# Altium schematic sheet 0015_Processor - MEMORY.SchDoc
size A3
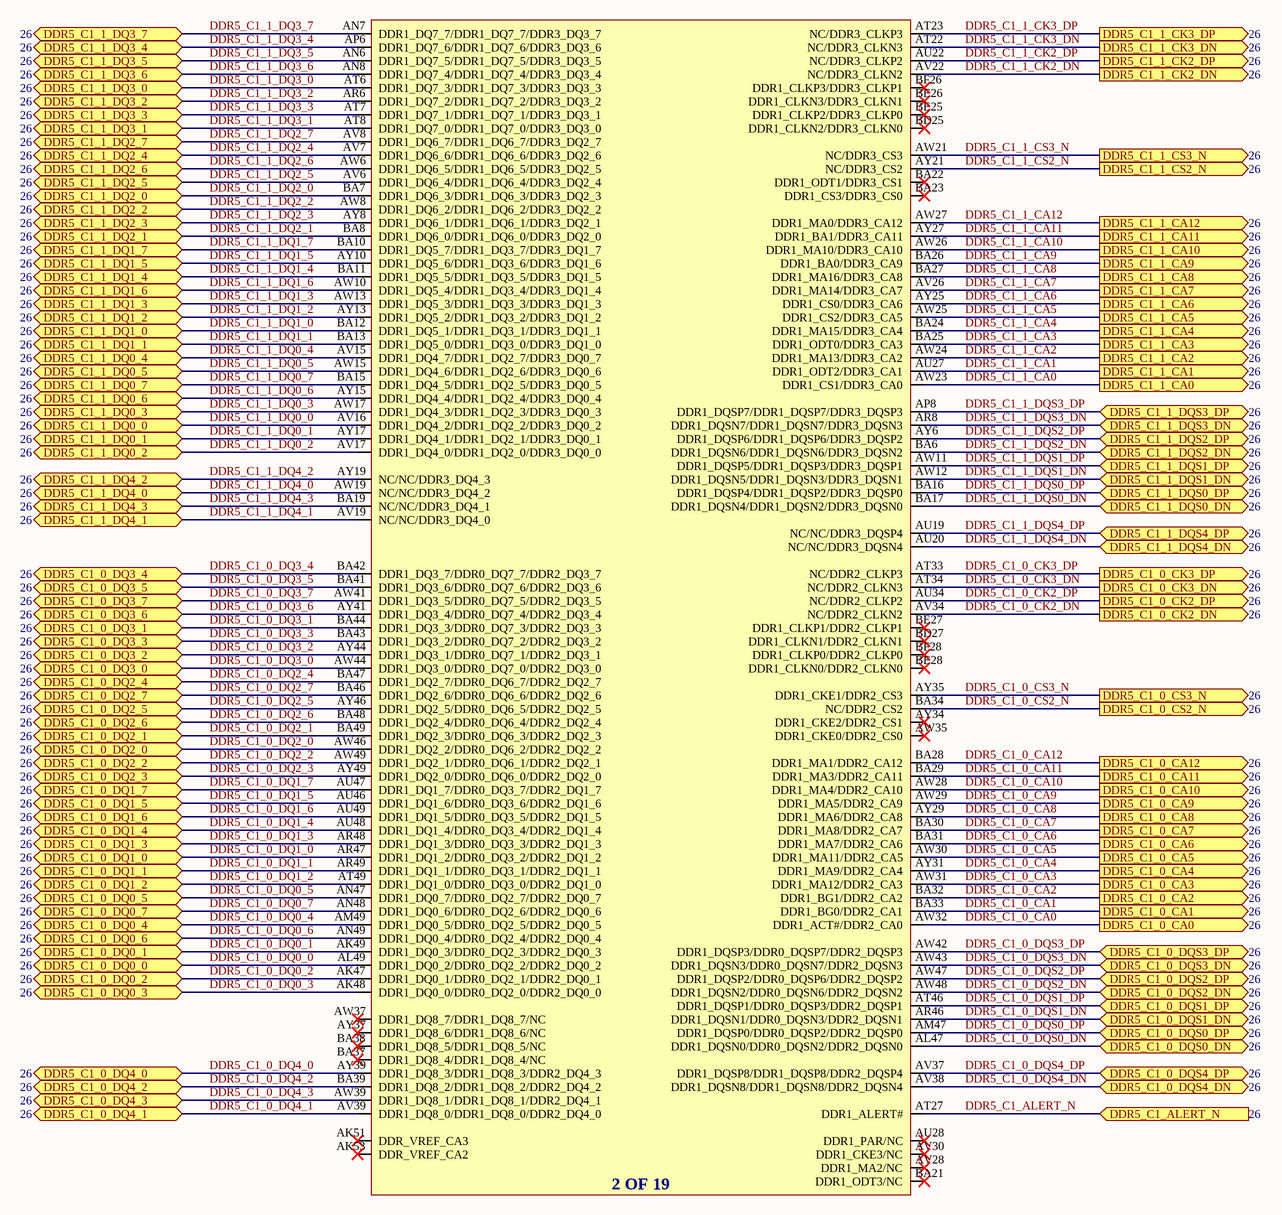
[diagram p0: 0015_Processor - MEMORY.SchDoc]

## Parts
U1401  C_RPL_HX_EXT  (value not drawn)  (part B of 19)

## Ports
DDR5_C1_0_CA0 (out), DDR5_C1_0_CA1 (out), DDR5_C1_0_CA2 (out), DDR5_C1_0_CA3 (out), DDR5_C1_0_CA4 (out), DDR5_C1_0_CA5 (out), DDR5_C1_0_CA6 (out), DDR5_C1_0_CA7 (out), DDR5_C1_0_CA8 (out), DDR5_C1_0_CA9 (out), DDR5_C1_0_CA10 (out), DDR5_C1_0_CA11 (out), DDR5_C1_0_CA12 (out), DDR5_C1_0_CK2_DN (out), DDR5_C1_0_CK2_DP (out), DDR5_C1_0_CK3_DN (out), DDR5_C1_0_CK3_DP (out), DDR5_C1_0_CS2_N (out), DDR5_C1_0_CS3_N (out), DDR5_C1_0_DQ0_0 (bidir), DDR5_C1_0_DQ0_1 (bidir), DDR5_C1_0_DQ0_2 (bidir), DDR5_C1_0_DQ0_3 (bidir), DDR5_C1_0_DQ0_4 (bidir), DDR5_C1_0_DQ0_5 (bidir), DDR5_C1_0_DQ0_6 (bidir), DDR5_C1_0_DQ0_7 (bidir), DDR5_C1_0_DQ1_0 (bidir), DDR5_C1_0_DQ1_1 (bidir), DDR5_C1_0_DQ1_2 (bidir), DDR5_C1_0_DQ1_3 (bidir), DDR5_C1_0_DQ1_4 (bidir), DDR5_C1_0_DQ1_5 (bidir), DDR5_C1_0_DQ1_6 (bidir), DDR5_C1_0_DQ1_7 (bidir), DDR5_C1_0_DQ2_0 (bidir), DDR5_C1_0_DQ2_1 (bidir), DDR5_C1_0_DQ2_2 (bidir), DDR5_C1_0_DQ2_3 (bidir), DDR5_C1_0_DQ2_4 (bidir), DDR5_C1_0_DQ2_5 (bidir), DDR5_C1_0_DQ2_6 (bidir), DDR5_C1_0_DQ2_7 (bidir), DDR5_C1_0_DQ3_0 (bidir), DDR5_C1_0_DQ3_1 (bidir), DDR5_C1_0_DQ3_2 (bidir), DDR5_C1_0_DQ3_3 (bidir), DDR5_C1_0_DQ3_4 (bidir), DDR5_C1_0_DQ3_5 (bidir), DDR5_C1_0_DQ3_6 (bidir), DDR5_C1_0_DQ3_7 (bidir), DDR5_C1_0_DQ4_0 (bidir), DDR5_C1_0_DQ4_1 (bidir), DDR5_C1_0_DQ4_2 (bidir), DDR5_C1_0_DQ4_3 (bidir), DDR5_C1_0_DQS0_DN (bidir), DDR5_C1_0_DQS0_DP (bidir), DDR5_C1_0_DQS1_DN (bidir), DDR5_C1_0_DQS1_DP (bidir), DDR5_C1_0_DQS2_DN (bidir), DDR5_C1_0_DQS2_DP (bidir), DDR5_C1_0_DQS3_DN (bidir), DDR5_C1_0_DQS3_DP (bidir), DDR5_C1_0_DQS4_DN (bidir), DDR5_C1_0_DQS4_DP (bidir), DDR5_C1_1_CA0 (out), DDR5_C1_1_CA1 (out), DDR5_C1_1_CA2 (out), DDR5_C1_1_CA3 (out), DDR5_C1_1_CA4 (out), DDR5_C1_1_CA5 (out), DDR5_C1_1_CA6 (out), DDR5_C1_1_CA7 (out), DDR5_C1_1_CA8 (out), DDR5_C1_1_CA9 (out), DDR5_C1_1_CA10 (out), DDR5_C1_1_CA11 (out), DDR5_C1_1_CA12 (out), DDR5_C1_1_CK2_DN (out), DDR5_C1_1_CK2_DP (out), DDR5_C1_1_CK3_DN (out), DDR5_C1_1_CK3_DP (out), DDR5_C1_1_CS2_N (out), DDR5_C1_1_CS3_N (out), DDR5_C1_1_DQ0_0 (bidir), DDR5_C1_1_DQ0_1 (bidir), DDR5_C1_1_DQ0_2 (bidir), DDR5_C1_1_DQ0_3 (bidir), DDR5_C1_1_DQ0_4 (bidir), DDR5_C1_1_DQ0_5 (bidir), DDR5_C1_1_DQ0_6 (bidir), DDR5_C1_1_DQ0_7 (bidir), DDR5_C1_1_DQ1_0 (bidir), DDR5_C1_1_DQ1_1 (bidir), DDR5_C1_1_DQ1_2 (bidir), DDR5_C1_1_DQ1_3 (bidir), DDR5_C1_1_DQ1_4 (bidir), DDR5_C1_1_DQ1_5 (bidir), DDR5_C1_1_DQ1_6 (bidir), DDR5_C1_1_DQ1_7 (bidir), DDR5_C1_1_DQ2_0 (bidir), DDR5_C1_1_DQ2_1 (bidir), DDR5_C1_1_DQ2_2 (bidir), DDR5_C1_1_DQ2_3 (bidir), DDR5_C1_1_DQ2_4 (bidir), DDR5_C1_1_DQ2_5 (bidir), DDR5_C1_1_DQ2_6 (bidir), DDR5_C1_1_DQ2_7 (bidir), DDR5_C1_1_DQ3_0 (bidir), DDR5_C1_1_DQ3_1 (bidir), DDR5_C1_1_DQ3_2 (bidir), DDR5_C1_1_DQ3_3 (bidir), DDR5_C1_1_DQ3_4 (bidir), DDR5_C1_1_DQ3_5 (bidir), DDR5_C1_1_DQ3_6 (bidir), DDR5_C1_1_DQ3_7 (bidir), DDR5_C1_1_DQ4_0 (bidir), DDR5_C1_1_DQ4_1 (bidir), DDR5_C1_1_DQ4_2 (bidir), DDR5_C1_1_DQ4_3 (bidir), DDR5_C1_1_DQS0_DN (bidir), DDR5_C1_1_DQS0_DP (bidir), DDR5_C1_1_DQS1_DN (bidir), DDR5_C1_1_DQS1_DP (bidir), DDR5_C1_1_DQS2_DN (bidir), DDR5_C1_1_DQS2_DP (bidir), DDR5_C1_1_DQS3_DN (bidir), DDR5_C1_1_DQS3_DP (bidir), DDR5_C1_1_DQS4_DN (bidir), DDR5_C1_1_DQS4_DP (bidir), DDR5_C1_ALERT_N (in)

## Nets
DDR5_C1_0_CA0: U1401.AW32(DDR1_ACT#/DDR2_CA0) ; port DDR5_C1_0_CA0
DDR5_C1_0_CA1: U1401.BA33(DDR1_BG0/DDR2_CA1) ; port DDR5_C1_0_CA1
DDR5_C1_0_CA2: U1401.BA32(DDR1_BG1/DDR2_CA2) ; port DDR5_C1_0_CA2
DDR5_C1_0_CA3: U1401.AW31(DDR1_MA12/DDR2_CA3) ; port DDR5_C1_0_CA3
DDR5_C1_0_CA4: U1401.AY31(DDR1_MA9/DDR2_CA4) ; port DDR5_C1_0_CA4
DDR5_C1_0_CA5: U1401.AW30(DDR1_MA11/DDR2_CA5) ; port DDR5_C1_0_CA5
DDR5_C1_0_CA6: U1401.BA31(DDR1_MA7/DDR2_CA6) ; port DDR5_C1_0_CA6
DDR5_C1_0_CA7: U1401.BA30(DDR1_MA8/DDR2_CA7) ; port DDR5_C1_0_CA7
DDR5_C1_0_CA8: U1401.AY29(DDR1_MA6/DDR2_CA8) ; port DDR5_C1_0_CA8
DDR5_C1_0_CA9: U1401.AW29(DDR1_MA5/DDR2_CA9) ; port DDR5_C1_0_CA9
DDR5_C1_0_CA10: U1401.AW28(DDR1_MA4/DDR2_CA10) ; port DDR5_C1_0_CA10
DDR5_C1_0_CA11: U1401.BA29(DDR1_MA3/DDR2_CA11) ; port DDR5_C1_0_CA11
DDR5_C1_0_CA12: U1401.BA28(DDR1_MA1/DDR2_CA12) ; port DDR5_C1_0_CA12
DDR5_C1_0_CK2_DN: U1401.AV34(NC/DDR2_CLKN2) ; port DDR5_C1_0_CK2_DN
DDR5_C1_0_CK2_DP: U1401.AU34(NC/DDR2_CLKP2) ; port DDR5_C1_0_CK2_DP
DDR5_C1_0_CK3_DN: U1401.AT34(NC/DDR2_CLKN3) ; port DDR5_C1_0_CK3_DN
DDR5_C1_0_CK3_DP: U1401.AT33(NC/DDR2_CLKP3) ; port DDR5_C1_0_CK3_DP
DDR5_C1_0_CS2_N: U1401.BA34(NC/DDR2_CS2) ; port DDR5_C1_0_CS2_N
DDR5_C1_0_CS3_N: U1401.AY35(DDR1_CKE1/DDR2_CS3) ; port DDR5_C1_0_CS3_N
DDR5_C1_0_DQ0_0: U1401.AL49(DDR1_DQ0_2/DDR0_DQ2_2/DDR2_DQ0_2) ; port DDR5_C1_0_DQ0_0
DDR5_C1_0_DQ0_1: U1401.AK49(DDR1_DQ0_3/DDR0_DQ2_3/DDR2_DQ0_3) ; port DDR5_C1_0_DQ0_1
DDR5_C1_0_DQ0_2: U1401.AK47(DDR1_DQ0_1/DDR0_DQ2_1/DDR2_DQ0_1) ; port DDR5_C1_0_DQ0_2
DDR5_C1_0_DQ0_3: U1401.AK48(DDR1_DQ0_0/DDR0_DQ2_0/DDR2_DQ0_0) ; port DDR5_C1_0_DQ0_3
DDR5_C1_0_DQ0_4: U1401.AM49(DDR1_DQ0_5/DDR0_DQ2_5/DDR2_DQ0_5) ; port DDR5_C1_0_DQ0_4
DDR5_C1_0_DQ0_5: U1401.AN47(DDR1_DQ0_7/DDR0_DQ2_7/DDR2_DQ0_7) ; port DDR5_C1_0_DQ0_5
DDR5_C1_0_DQ0_6: U1401.AN49(DDR1_DQ0_4/DDR0_DQ2_4/DDR2_DQ0_4) ; port DDR5_C1_0_DQ0_6
DDR5_C1_0_DQ0_7: U1401.AN48(DDR1_DQ0_6/DDR0_DQ2_6/DDR2_DQ0_6) ; port DDR5_C1_0_DQ0_7
DDR5_C1_0_DQ1_0: U1401.AR47(DDR1_DQ1_2/DDR0_DQ3_2/DDR2_DQ1_2) ; port DDR5_C1_0_DQ1_0
DDR5_C1_0_DQ1_1: U1401.AR49(DDR1_DQ1_1/DDR0_DQ3_1/DDR2_DQ1_1) ; port DDR5_C1_0_DQ1_1
DDR5_C1_0_DQ1_2: U1401.AT49(DDR1_DQ1_0/DDR0_DQ3_0/DDR2_DQ1_0) ; port DDR5_C1_0_DQ1_2
DDR5_C1_0_DQ1_3: U1401.AR48(DDR1_DQ1_3/DDR0_DQ3_3/DDR2_DQ1_3) ; port DDR5_C1_0_DQ1_3
DDR5_C1_0_DQ1_4: U1401.AU48(DDR1_DQ1_4/DDR0_DQ3_4/DDR2_DQ1_4) ; port DDR5_C1_0_DQ1_4
DDR5_C1_0_DQ1_5: U1401.AU46(DDR1_DQ1_6/DDR0_DQ3_6/DDR2_DQ1_6) ; port DDR5_C1_0_DQ1_5
DDR5_C1_0_DQ1_6: U1401.AU49(DDR1_DQ1_5/DDR0_DQ3_5/DDR2_DQ1_5) ; port DDR5_C1_0_DQ1_6
DDR5_C1_0_DQ1_7: U1401.AU47(DDR1_DQ1_7/DDR0_DQ3_7/DDR2_DQ1_7) ; port DDR5_C1_0_DQ1_7
DDR5_C1_0_DQ2_0: U1401.AW46(DDR1_DQ2_2/DDR0_DQ6_2/DDR2_DQ2_2) ; port DDR5_C1_0_DQ2_0
DDR5_C1_0_DQ2_1: U1401.BA49(DDR1_DQ2_3/DDR0_DQ6_3/DDR2_DQ2_3) ; port DDR5_C1_0_DQ2_1
DDR5_C1_0_DQ2_2: U1401.AW49(DDR1_DQ2_1/DDR0_DQ6_1/DDR2_DQ2_1) ; port DDR5_C1_0_DQ2_2
DDR5_C1_0_DQ2_3: U1401.AY49(DDR1_DQ2_0/DDR0_DQ6_0/DDR2_DQ2_0) ; port DDR5_C1_0_DQ2_3
DDR5_C1_0_DQ2_4: U1401.BA47(DDR1_DQ2_7/DDR0_DQ6_7/DDR2_DQ2_7) ; port DDR5_C1_0_DQ2_4
DDR5_C1_0_DQ2_5: U1401.AY46(DDR1_DQ2_5/DDR0_DQ6_5/DDR2_DQ2_5) ; port DDR5_C1_0_DQ2_5
DDR5_C1_0_DQ2_6: U1401.BA48(DDR1_DQ2_4/DDR0_DQ6_4/DDR2_DQ2_4) ; port DDR5_C1_0_DQ2_6
DDR5_C1_0_DQ2_7: U1401.BA46(DDR1_DQ2_6/DDR0_DQ6_6/DDR2_DQ2_6) ; port DDR5_C1_0_DQ2_7
DDR5_C1_0_DQ3_0: U1401.AW44(DDR1_DQ3_0/DDR0_DQ7_0/DDR2_DQ3_0) ; port DDR5_C1_0_DQ3_0
DDR5_C1_0_DQ3_1: U1401.BA44(DDR1_DQ3_3/DDR0_DQ7_3/DDR2_DQ3_3) ; port DDR5_C1_0_DQ3_1
DDR5_C1_0_DQ3_2: U1401.AY44(DDR1_DQ3_1/DDR0_DQ7_1/DDR2_DQ3_1) ; port DDR5_C1_0_DQ3_2
DDR5_C1_0_DQ3_3: U1401.BA43(DDR1_DQ3_2/DDR0_DQ7_2/DDR2_DQ3_2) ; port DDR5_C1_0_DQ3_3
DDR5_C1_0_DQ3_4: U1401.BA42(DDR1_DQ3_7/DDR0_DQ7_7/DDR2_DQ3_7) ; port DDR5_C1_0_DQ3_4
DDR5_C1_0_DQ3_5: U1401.BA41(DDR1_DQ3_6/DDR0_DQ7_6/DDR2_DQ3_6) ; port DDR5_C1_0_DQ3_5
DDR5_C1_0_DQ3_6: U1401.AY41(DDR1_DQ3_4/DDR0_DQ7_4/DDR2_DQ3_4) ; port DDR5_C1_0_DQ3_6
DDR5_C1_0_DQ3_7: U1401.AW41(DDR1_DQ3_5/DDR0_DQ7_5/DDR2_DQ3_5) ; port DDR5_C1_0_DQ3_7
DDR5_C1_0_DQ4_0: U1401.AY39(DDR1_DQ8_3/DDR1_DQ8_3/DDR2_DQ4_3) ; port DDR5_C1_0_DQ4_0
DDR5_C1_0_DQ4_1: U1401.AV39(DDR1_DQ8_0/DDR1_DQ8_0/DDR2_DQ4_0) ; port DDR5_C1_0_DQ4_1
DDR5_C1_0_DQ4_2: U1401.BA39(DDR1_DQ8_2/DDR1_DQ8_2/DDR2_DQ4_2) ; port DDR5_C1_0_DQ4_2
DDR5_C1_0_DQ4_3: U1401.AW39(DDR1_DQ8_1/DDR1_DQ8_1/DDR2_DQ4_1) ; port DDR5_C1_0_DQ4_3
DDR5_C1_0_DQS0_DN: U1401.AL47(DDR1_DQSN0/DDR0_DQSN2/DDR2_DQSN0) ; port DDR5_C1_0_DQS0_DN
DDR5_C1_0_DQS0_DP: U1401.AM47(DDR1_DQSP0/DDR0_DQSP2/DDR2_DQSP0) ; port DDR5_C1_0_DQS0_DP
DDR5_C1_0_DQS1_DN: U1401.AR46(DDR1_DQSN1/DDR0_DQSN3/DDR2_DQSN1) ; port DDR5_C1_0_DQS1_DN
DDR5_C1_0_DQS1_DP: U1401.AT46(DDR1_DQSP1/DDR0_DQSP3/DDR2_DQSP1) ; port DDR5_C1_0_DQS1_DP
DDR5_C1_0_DQS2_DN: U1401.AW48(DDR1_DQSN2/DDR0_DQSN6/DDR2_DQSN2) ; port DDR5_C1_0_DQS2_DN
DDR5_C1_0_DQS2_DP: U1401.AW47(DDR1_DQSP2/DDR0_DQSP6/DDR2_DQSP2) ; port DDR5_C1_0_DQS2_DP
DDR5_C1_0_DQS3_DN: U1401.AW43(DDR1_DQSN3/DDR0_DQSN7/DDR2_DQSN3) ; port DDR5_C1_0_DQS3_DN
DDR5_C1_0_DQS3_DP: U1401.AW42(DDR1_DQSP3/DDR0_DQSP7/DDR2_DQSP3) ; port DDR5_C1_0_DQS3_DP
DDR5_C1_0_DQS4_DN: U1401.AV38(DDR1_DQSN8/DDR1_DQSN8/DDR2_DQSN4) ; port DDR5_C1_0_DQS4_DN
DDR5_C1_0_DQS4_DP: U1401.AV37(DDR1_DQSP8/DDR1_DQSP8/DDR2_DQSP4) ; port DDR5_C1_0_DQS4_DP
DDR5_C1_1_CA0: U1401.AW23(DDR1_CS1/DDR3_CA0) ; port DDR5_C1_1_CA0
DDR5_C1_1_CA1: U1401.AU27(DDR1_ODT2/DDR3_CA1) ; port DDR5_C1_1_CA1
DDR5_C1_1_CA2: U1401.AW24(DDR1_MA13/DDR3_CA2) ; port DDR5_C1_1_CA2
DDR5_C1_1_CA3: U1401.BA25(DDR1_ODT0/DDR3_CA3) ; port DDR5_C1_1_CA3
DDR5_C1_1_CA4: U1401.BA24(DDR1_MA15/DDR3_CA4) ; port DDR5_C1_1_CA4
DDR5_C1_1_CA5: U1401.AW25(DDR1_CS2/DDR3_CA5) ; port DDR5_C1_1_CA5
DDR5_C1_1_CA6: U1401.AY25(DDR1_CS0/DDR3_CA6) ; port DDR5_C1_1_CA6
DDR5_C1_1_CA7: U1401.AV26(DDR1_MA14/DDR3_CA7) ; port DDR5_C1_1_CA7
DDR5_C1_1_CA8: U1401.BA27(DDR1_MA16/DDR3_CA8) ; port DDR5_C1_1_CA8
DDR5_C1_1_CA9: U1401.BA26(DDR1_BA0/DDR3_CA9) ; port DDR5_C1_1_CA9
DDR5_C1_1_CA10: U1401.AW26(DDR1_MA10/DDR3_CA10) ; port DDR5_C1_1_CA10
DDR5_C1_1_CA11: U1401.AY27(DDR1_BA1/DDR3_CA11) ; port DDR5_C1_1_CA11
DDR5_C1_1_CA12: U1401.AW27(DDR1_MA0/DDR3_CA12) ; port DDR5_C1_1_CA12
DDR5_C1_1_CK2_DN: U1401.AV22(NC/DDR3_CLKN2) ; port DDR5_C1_1_CK2_DN
DDR5_C1_1_CK2_DP: U1401.AU22(NC/DDR3_CLKP2) ; port DDR5_C1_1_CK2_DP
DDR5_C1_1_CK3_DN: U1401.AT22(NC/DDR3_CLKN3) ; port DDR5_C1_1_CK3_DN
DDR5_C1_1_CK3_DP: U1401.AT23(NC/DDR3_CLKP3) ; port DDR5_C1_1_CK3_DP
DDR5_C1_1_CS2_N: U1401.AY21(NC/DDR3_CS2) ; port DDR5_C1_1_CS2_N
DDR5_C1_1_CS3_N: U1401.AW21(NC/DDR3_CS3) ; port DDR5_C1_1_CS3_N
DDR5_C1_1_DQ0_0: U1401.AV16(DDR1_DQ4_2/DDR1_DQ2_2/DDR3_DQ0_2) ; port DDR5_C1_1_DQ0_0
DDR5_C1_1_DQ0_1: U1401.AY17(DDR1_DQ4_1/DDR1_DQ2_1/DDR3_DQ0_1) ; port DDR5_C1_1_DQ0_1
DDR5_C1_1_DQ0_2: U1401.AV17(DDR1_DQ4_0/DDR1_DQ2_0/DDR3_DQ0_0) ; port DDR5_C1_1_DQ0_2
DDR5_C1_1_DQ0_3: U1401.AW17(DDR1_DQ4_3/DDR1_DQ2_3/DDR3_DQ0_3) ; port DDR5_C1_1_DQ0_3
DDR5_C1_1_DQ0_4: U1401.AV15(DDR1_DQ4_7/DDR1_DQ2_7/DDR3_DQ0_7) ; port DDR5_C1_1_DQ0_4
DDR5_C1_1_DQ0_5: U1401.AW15(DDR1_DQ4_6/DDR1_DQ2_6/DDR3_DQ0_6) ; port DDR5_C1_1_DQ0_5
DDR5_C1_1_DQ0_6: U1401.AY15(DDR1_DQ4_4/DDR1_DQ2_4/DDR3_DQ0_4) ; port DDR5_C1_1_DQ0_6
DDR5_C1_1_DQ0_7: U1401.BA15(DDR1_DQ4_5/DDR1_DQ2_5/DDR3_DQ0_5) ; port DDR5_C1_1_DQ0_7
DDR5_C1_1_DQ1_0: U1401.BA12(DDR1_DQ5_1/DDR1_DQ3_1/DDR3_DQ1_1) ; port DDR5_C1_1_DQ1_0
DDR5_C1_1_DQ1_1: U1401.BA13(DDR1_DQ5_0/DDR1_DQ3_0/DDR3_DQ1_0) ; port DDR5_C1_1_DQ1_1
DDR5_C1_1_DQ1_2: U1401.AY13(DDR1_DQ5_2/DDR1_DQ3_2/DDR3_DQ1_2) ; port DDR5_C1_1_DQ1_2
DDR5_C1_1_DQ1_3: U1401.AW13(DDR1_DQ5_3/DDR1_DQ3_3/DDR3_DQ1_3) ; port DDR5_C1_1_DQ1_3
DDR5_C1_1_DQ1_4: U1401.BA11(DDR1_DQ5_5/DDR1_DQ3_5/DDR3_DQ1_5) ; port DDR5_C1_1_DQ1_4
DDR5_C1_1_DQ1_5: U1401.AY10(DDR1_DQ5_6/DDR1_DQ3_6/DDR3_DQ1_6) ; port DDR5_C1_1_DQ1_5
DDR5_C1_1_DQ1_6: U1401.AW10(DDR1_DQ5_4/DDR1_DQ3_4/DDR3_DQ1_4) ; port DDR5_C1_1_DQ1_6
DDR5_C1_1_DQ1_7: U1401.BA10(DDR1_DQ5_7/DDR1_DQ3_7/DDR3_DQ1_7) ; port DDR5_C1_1_DQ1_7
DDR5_C1_1_DQ2_0: U1401.BA7(DDR1_DQ6_3/DDR1_DQ6_3/DDR3_DQ2_3) ; port DDR5_C1_1_DQ2_0
DDR5_C1_1_DQ2_1: U1401.BA8(DDR1_DQ6_0/DDR1_DQ6_0/DDR3_DQ2_0) ; port DDR5_C1_1_DQ2_1
DDR5_C1_1_DQ2_2: U1401.AW8(DDR1_DQ6_2/DDR1_DQ6_2/DDR3_DQ2_2) ; port DDR5_C1_1_DQ2_2
DDR5_C1_1_DQ2_3: U1401.AY8(DDR1_DQ6_1/DDR1_DQ6_1/DDR3_DQ2_1) ; port DDR5_C1_1_DQ2_3
DDR5_C1_1_DQ2_4: U1401.AV7(DDR1_DQ6_6/DDR1_DQ6_6/DDR3_DQ2_6) ; port DDR5_C1_1_DQ2_4
DDR5_C1_1_DQ2_5: U1401.AV6(DDR1_DQ6_4/DDR1_DQ6_4/DDR3_DQ2_4) ; port DDR5_C1_1_DQ2_5
DDR5_C1_1_DQ2_6: U1401.AW6(DDR1_DQ6_5/DDR1_DQ6_5/DDR3_DQ2_5) ; port DDR5_C1_1_DQ2_6
DDR5_C1_1_DQ2_7: U1401.AV8(DDR1_DQ6_7/DDR1_DQ6_7/DDR3_DQ2_7) ; port DDR5_C1_1_DQ2_7
DDR5_C1_1_DQ3_0: U1401.AT6(DDR1_DQ7_3/DDR1_DQ7_3/DDR3_DQ3_3) ; port DDR5_C1_1_DQ3_0
DDR5_C1_1_DQ3_1: U1401.AT8(DDR1_DQ7_0/DDR1_DQ7_0/DDR3_DQ3_0) ; port DDR5_C1_1_DQ3_1
DDR5_C1_1_DQ3_2: U1401.AR6(DDR1_DQ7_2/DDR1_DQ7_2/DDR3_DQ3_2) ; port DDR5_C1_1_DQ3_2
DDR5_C1_1_DQ3_3: U1401.AT7(DDR1_DQ7_1/DDR1_DQ7_1/DDR3_DQ3_1) ; port DDR5_C1_1_DQ3_3
DDR5_C1_1_DQ3_4: U1401.AP6(DDR1_DQ7_6/DDR1_DQ7_6/DDR3_DQ3_6) ; port DDR5_C1_1_DQ3_4
DDR5_C1_1_DQ3_5: U1401.AN6(DDR1_DQ7_5/DDR1_DQ7_5/DDR3_DQ3_5) ; port DDR5_C1_1_DQ3_5
DDR5_C1_1_DQ3_6: U1401.AN8(DDR1_DQ7_4/DDR1_DQ7_4/DDR3_DQ3_4) ; port DDR5_C1_1_DQ3_6
DDR5_C1_1_DQ3_7: U1401.AN7(DDR1_DQ7_7/DDR1_DQ7_7/DDR3_DQ3_7) ; port DDR5_C1_1_DQ3_7
DDR5_C1_1_DQ4_0: U1401.AW19(NC/NC/DDR3_DQ4_2) ; port DDR5_C1_1_DQ4_0
DDR5_C1_1_DQ4_1: U1401.AV19(NC/NC/DDR3_DQ4_0) ; port DDR5_C1_1_DQ4_1
DDR5_C1_1_DQ4_2: U1401.AY19(NC/NC/DDR3_DQ4_3) ; port DDR5_C1_1_DQ4_2
DDR5_C1_1_DQ4_3: U1401.BA19(NC/NC/DDR3_DQ4_1) ; port DDR5_C1_1_DQ4_3
DDR5_C1_1_DQS0_DN: U1401.BA17(DDR1_DQSN4/DDR1_DQSN2/DDR3_DQSN0) ; port DDR5_C1_1_DQS0_DN
DDR5_C1_1_DQS0_DP: U1401.BA16(DDR1_DQSP4/DDR1_DQSP2/DDR3_DQSP0) ; port DDR5_C1_1_DQS0_DP
DDR5_C1_1_DQS1_DN: U1401.AW12(DDR1_DQSN5/DDR1_DQSN3/DDR3_DQSN1) ; port DDR5_C1_1_DQS1_DN
DDR5_C1_1_DQS1_DP: U1401.AW11(DDR1_DQSP5/DDR1_DQSP3/DDR3_DQSP1) ; port DDR5_C1_1_DQS1_DP
DDR5_C1_1_DQS2_DN: U1401.BA6(DDR1_DQSN6/DDR1_DQSN6/DDR3_DQSN2) ; port DDR5_C1_1_DQS2_DN
DDR5_C1_1_DQS2_DP: U1401.AY6(DDR1_DQSP6/DDR1_DQSP6/DDR3_DQSP2) ; port DDR5_C1_1_DQS2_DP
DDR5_C1_1_DQS3_DN: U1401.AR8(DDR1_DQSN7/DDR1_DQSN7/DDR3_DQSN3) ; port DDR5_C1_1_DQS3_DN
DDR5_C1_1_DQS3_DP: U1401.AP8(DDR1_DQSP7/DDR1_DQSP7/DDR3_DQSP3) ; port DDR5_C1_1_DQS3_DP
DDR5_C1_1_DQS4_DN: U1401.AU20(NC/NC/DDR3_DQSN4) ; port DDR5_C1_1_DQS4_DN
DDR5_C1_1_DQS4_DP: U1401.AU19(NC/NC/DDR3_DQSP4) ; port DDR5_C1_1_DQS4_DP
DDR5_C1_ALERT_N: U1401.AT27(DDR1_ALERT#) ; port DDR5_C1_ALERT_N

Not connected (* = marked no-connect by the designer): U1401 AK51(DDR_VREF_CA3)* AK53(DDR_VREF_CA2)* AU28(DDR1_PAR/NC)* AV28(DDR1_MA2/NC)* AV30(DDR1_CKE3/NC)* AW35(DDR1_CKE0/DDR2_CS0)* AW37(DDR1_DQ8_7/DDR1_DQ8_7/NC)* AY34(DDR1_CKE2/DDR2_CS1)* AY37(DDR1_DQ8_6/DDR1_DQ8_6/NC)* BA21(DDR1_ODT3/NC)* BA22(DDR1_ODT1/DDR3_CS1)* BA23(DDR1_CS3/DDR3_CS0)* BA37(DDR1_DQ8_4/DDR1_DQ8_4/NC)* BA38(DDR1_DQ8_5/DDR1_DQ8_5/NC)* BD25(DDR1_CLKN2/DDR3_CLKN0)* BD27(DDR1_CLKN1/DDR2_CLKN1)* BE25(DDR1_CLKP2/DDR3_CLKP0)* BE26(DDR1_CLKN3/DDR3_CLKN1)* BE27(DDR1_CLKP1/DDR2_CLKP1)* BE28(DDR1_CLKN0/DDR2_CLKN0)* BF26(DDR1_CLKP3/DDR3_CLKP1)* BF28(DDR1_CLKP0/DDR2_CLKP0)*

## Notes on the sheet
- (in symbol C_RPL_HX_EXT, part B) 2 OF 19